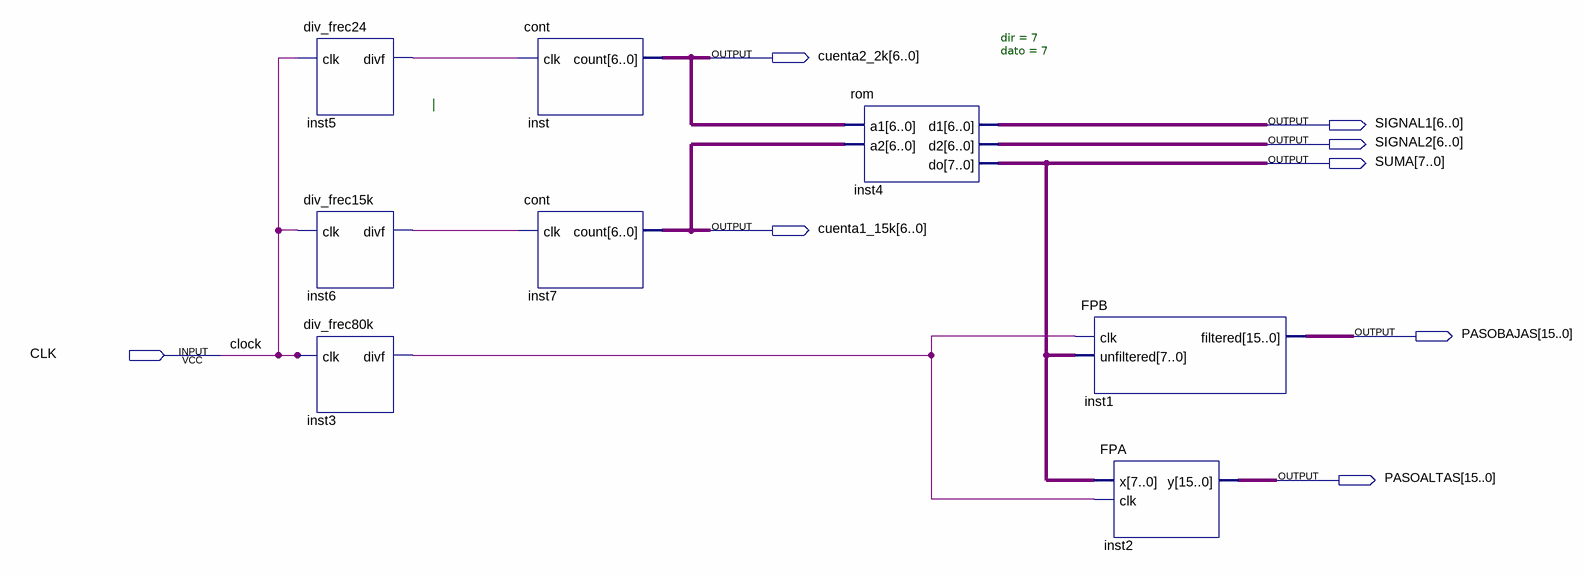
[diagram p0: schematic sheet]
// Quartus schematic Block1.bdf as structural Verilog: 8 symbols, 8 pins
module Block1 (
  input  CLK,
  output [6:0] cuenta2_2k,
  output [6:0] SIGNAL1,
  output [6:0] SIGNAL2,
  output [7:0] SUMA,
  output [6:0] cuenta1_15k,
  output [15:0] PASOBAJAS,
  output [15:0] PASOALTAS
);

  wire inst3_divf, inst5_divf, inst6_divf;

  div_frec24 inst5 (.clk(CLK), .divf(inst5_divf));
  div_frec15k inst6 (.clk(CLK), .divf(inst6_divf));
  div_frec80k inst3 (.clk(CLK), .divf(inst3_divf));
  cont inst (.clk(inst5_divf), .count(cuenta2_2k));
  cont inst7 (.clk(inst6_divf), .count(cuenta1_15k));
  rom #(.dir(7), .dato(7)) inst4 (.a1(cuenta2_2k), .a2(cuenta1_15k), .d1(SIGNAL1), .d2(SIGNAL2), .\do (SUMA));
  FPB inst1 (.clk(inst3_divf), .unfiltered(SUMA), .filtered(PASOBAJAS));
  FPA inst2 (.x(SUMA), .clk(inst3_divf), .y(PASOALTAS));

  // Other names for the same wires on the sheet: clock = CLK

  // Notes on the sheet:
  //   |
endmodule
